# EAGLE design Bakelite Interface Board v1.1 (EAGLE 9.6.2)
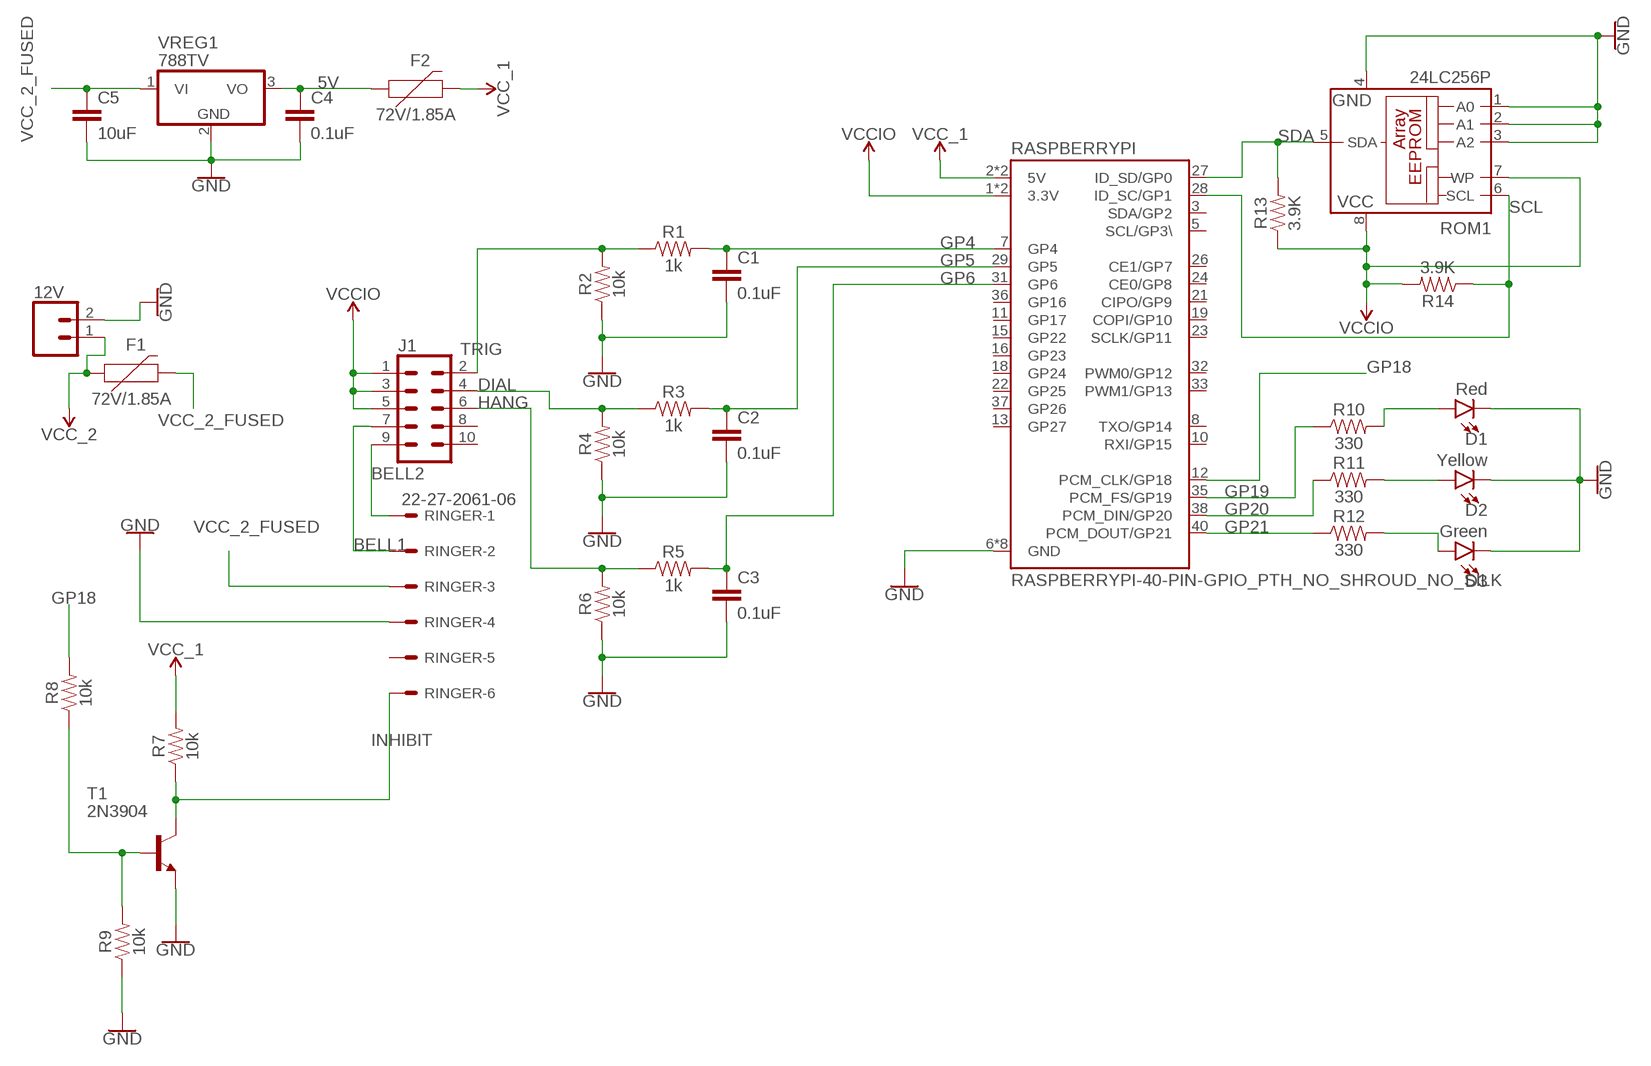
[diagram p0: schematic, sheet 1]

## Parts
12V  CONN_025MM  [SCREWTERMINAL-5MM-2]
C1  0.1uF  0.1UF-KIT-EZ-50V-20%  [CAP-PTH-SMALL-KIT]
C2  0.1uF  0.1UF-KIT-EZ-50V-20%  [CAP-PTH-SMALL-KIT]
C3  0.1uF  0.1UF-KIT-EZ-50V-20%  [CAP-PTH-SMALL-KIT]
C4  0.1uF  0.1UF-KIT-EZ-50V-20%  [CAP-PTH-SMALL-KIT]
C5  10uF  0.1UF-KIT-EZ-50V-20%  [CAP-PTH-SMALL-KIT]
D1  Red  LED5MM  [LED_5MM]
D2  Yellow  LED5MM  [LED_5MM]
D3  Green  LED5MM  [LED_5MM]
F1  72V/1.85A  PPTC_PTH  [PTH]
F2  72V/1.85A  PPTC_PTH  [PTH]
J1  CONN_05X2PTH  [2X5]
R1  1k  1KOHM-HORIZ-1/4W-5%  [AXIAL-0.3]
R2  10k  10KOHM-HORIZ-1/4W-5%  [AXIAL-0.3]
R3  1k  1KOHM-HORIZ-1/4W-5%  [AXIAL-0.3]
R4  10k  10KOHM-HORIZ-1/4W-5%  [AXIAL-0.3]
R5  1k  1KOHM-HORIZ-1/4W-5%  [AXIAL-0.3]
R6  10k  10KOHM-HORIZ-1/4W-5%  [AXIAL-0.3]
R7  10k  10KOHM-HORIZ-1/4W-5%  [AXIAL-0.3]
R8  10k  10KOHM-HORIZ-1/4W-5%  [AXIAL-0.3]
R9  10k  10KOHM-HORIZ-1/4W-5%  [AXIAL-0.3]
R10  330  330OHM-HORIZ-1/10W-5%  [AXIAL-0.3]
R11  330  330OHM-HORIZ-1/10W-5%  [AXIAL-0.3]
R12  330  330OHM-HORIZ-1/10W-5%  [AXIAL-0.3]
R13  3.9K  RESISTORAXIAL-0.3  [AXIAL-0.3]
R14  3.9K  RESISTORAXIAL-0.3  [AXIAL-0.3]
RASPBERRYPI  RASPBERRYPI-40-PIN-GPIO_PTH_NO_SHROUD_NO_SILK  [2X20_NOSILK]
RINGER  22-27-2061-06  [6410-06]
ROM1  24LC256P  [DIL8]
T1  2N3904  [TO92]
VREG1  788TV  [TO220V]

## Nets
5V: C4.1 F2.P$1 VREG1.3(VO)
BELL1: J1.7 RINGER.2
BELL2: J1.9 RINGER.1
DIAL: J1.4 R3.P$1 R4.P$2
GND: 12V.2 C1.2 C2.2 C3.2 C4.2 C5.2 D1.K(C) D2.K(C) D3.K(C) R2.P$1 R4.P$1 R6.P$1 R9.P$1 RASPBERRYPI.6(GND) RASPBERRYPI.9(GND) RASPBERRYPI.14(GND) RASPBERRYPI.20(GND) RASPBERRYPI.25(GND) RASPBERRYPI.30(GND) RASPBERRYPI.34(GND) RASPBERRYPI.39(GND) RINGER.4 ROM1.1(A0) ROM1.2(A1) ROM1.3(A2) ROM1.4(GND) T1.3(E) VREG1.2(GND)
GP4: C1.1 R1.P$2 RASPBERRYPI.7(GP4)
GP5: C2.1 R3.P$2 RASPBERRYPI.29(GP5)
GP6: C3.1 R5.P$2 RASPBERRYPI.31(GP6)
GP18: R8.P$2 RASPBERRYPI.12(PCM_CLK/GP18)
GP19: R10.P$1 RASPBERRYPI.35(PCM_FS/GP19)
GP20: R11.P$1 RASPBERRYPI.38(PCM_DIN/GP20)
GP21: R12.P$1 RASPBERRYPI.40(PCM_DOUT/GP21)
HANG: J1.6 R5.P$1 R6.P$2
INHIBIT: R7.P$1 RINGER.6 T1.1(C)
N$10: R8.P$1 R9.P$2 T1.2(B)
N$22: D1.A R10.P$2
N$23: D2.A R11.P$2
N$24: D3.A R12.P$2
SCL: R14.P$1 RASPBERRYPI.28(ID_SC/GP1) ROM1.6(SCL)
SDA: R13.P$2 RASPBERRYPI.27(ID_SD/GP0) ROM1.5(SDA)
TRIG: J1.2 R1.P$1 R2.P$2
VCC_1: F2.P$2 R7.P$2 RASPBERRYPI.2(5V) RASPBERRYPI.4(5V)
VCC_2 [2A]: 12V.1 F1.P$1
VCC_2_FUSED [2A]: C5.1 F1.P$2 RINGER.3 VREG1.1(VI)
VCCIO: J1.1 J1.3 J1.5 R13.P$1 R14.P$2 RASPBERRYPI.1(3.3V) RASPBERRYPI.17(3.3V) ROM1.7(WP) ROM1.8(VCC)
Unconnected: J1.8 J1.10 RASPBERRYPI.3(SDA/GP2) RASPBERRYPI.5(SCL/GP3\) RASPBERRYPI.8(TXO/GP14) RASPBERRYPI.10(RXI/GP15) RASPBERRYPI.11(GP17) RASPBERRYPI.13(GP27) RASPBERRYPI.15(GP22) RASPBERRYPI.16(GP23) RASPBERRYPI.18(GP24) RASPBERRYPI.19(COPI/GP10) RASPBERRYPI.21(CIPO/GP9) RASPBERRYPI.22(GP25) RASPBERRYPI.23(SCLK/GP11) RASPBERRYPI.24(CE0/GP8) RASPBERRYPI.26(CE1/GP7) RASPBERRYPI.32(PWM0/GP12) RASPBERRYPI.33(PWM1/GP13) RASPBERRYPI.36(GP16) RASPBERRYPI.37(GP26) RINGER.5

## Library data of the parts
12V = SparkFun-Connectors:CONN_02: Multi connection point. Often used as Generic Header-pin footprint for 0.1 inch spaced/style header connections On any of the 0.1 inch spaced packages, you can populate with these: Break Away Headers - Straight <https://www.sparkfun.com/products/116> (PRT-00116) Break Away Male Headers - Right Angle <https://www.sparkfun.com/products/553> (PRT-00553) Female Headers <https://www.sparkfun.com/products/115> (PRT-00115) Break Away Headers - Machine Pin <https://www.sparkfun.com/products/117> (PRT-00117) Break Away Female Headers - Swiss Machine Pin <https://www.sparkfun.com/products/743> (PRT-00743) For SCREWTERMINALS and SPRING TERMINALS visit here: Screw Terimnals on SparkFun.com <https://www.sparkfun.com/search/results?term=Screw+Terminals> (5mm/3.5mm/2.54mm spacing) This device is also useful as a general connection point to wire up your design to another part of your project. Our various solder wires solder well into these plated through hole pads. Hook-Up Wire - Assortment (Stranded, 22 AWG) <https://www.sparkfun.com/products/11375> (PRT-11375) Hook-Up Wire - Assortment (Solid Core, 22 AWG) <https://www.sparkfun.com/products/11367> (PRT-11367) View the entire wire category on our website here <https://www.sparkfun.com/categories/141> Special notes: Molex polarized connector foot print use with: PRT-08233 with associated crimp pins and housings. 2.54_SCREWTERM for use with PRT-10571. 3.5mm Screw Terminal footprints for PRT-08084 5mm Screw Terminal footprints for use with PRT-08432; SF_SKU: PRT-08432
C1-C4 = SparkFun-Capacitors:0.1UF: 0.1µF ceramic capacitors A capacitor is a passive two-terminal electrical component used to store electrical energy temporarily in an electric field.; PROD_ID: CAP-08370
C5 = SparkFun-Capacitors:0.1UF: 0.1µF ceramic capacitors A capacitor is a passive two-terminal electrical component used to store electrical energy temporarily in an electric field.; PROD_ID: CAP-08370; VALUE: 0.1uF
D1-D3 = SparkFun-LED:LED: LED (Generic) Standard schematic elements and footprints for 5mm, 3mm, 1206, and 0603 sized LEDs. Generic LEDs with no color specified.
F1 F2 = SparkFun-Fuses:PPTC: Resettable Fuse PPTC Resettable Fuse. Really a sort of resistor with a polymeric positive temperature coefficient whose resistance increases dramatically with an increase in temperature. When heated by the power passing through the resistance rises causing the current to be limited, protecting the circuit. This is achieved by the transition of the polymer from a crystalline to an amorphous state where the conductive carbon separates breaking the conductive pathways found in the cool crystalline structure. When a PPTC cools back down it resumes conducting letting the circuit turn back on. SparkFun Products: SparkFun RedBoard - Programmed with Arduino <https://www.sparkfun.com/products/12757> Pro Micro - 5V/16MHz <https://www.sparkfun.com/products/12640> Arduino Pro 328 - 5V/16MHz <https://www.sparkfun.com/products/10915> MP3 Trigger <https://www.sparkfun.com/products/13720>; PROD_ID: RES-08490; VALUE: 72V/0.25A
J1 = SparkFun-Connectors:CONN_05X2: Multi connection point. Often used as Generic Header-pin footprint for 0.1 inch spaced/style header connections For AVR SPI programming port, see special device with nice symbol: "AVR_SPI_PROG_5x2.dev" You can populate with any combo of single row headers, but if you'd like an exact match, check these: 2x5 AVR ICSP Male Header <https://www.sparkfun.com/products/778> (PRT-00778) 2x5 Pin Shrouded Header <https://www.sparkfun.com/products/8506> (PRT-08506) On any of the 0.1 inch spaced packages, you can populate with these: Break Away Headers - Straight <https://www.sparkfun.com/products/116> (PRT-00116) Break Away Male Headers - Right Angle <https://www.sparkfun.com/products/553> (PRT-00553) Female Headers <https://www.sparkfun.com/products/115> (PRT-00115) Break Away Headers - Machine Pin <https://www.sparkfun.com/products/117> (PRT-00117) Break Away Female Headers - Swiss Machine Pin <https://www.sparkfun.com/products/743> (PRT-00743) Special note: the shrouded connector mates well with our 5x2 ribbon cables: 2x5 Pin IDC Ribbon Cable <https://www.sparkfun.com/products/8535> (PRT-08535); PROD_ID: CONN-08499; SF_ID: PRT-0778
R1 R3 R5 = SparkFun-Resistors:1KOHM: 1kΩ resistor A resistor is a passive two-terminal electrical component that implements electrical resistance as a circuit element. Resistors act to reduce current flow, and, at the same time, act to lower voltage levels within circuits. - Wikipedia; PROD_ID: RES-08380
R2 R4 R6-R9 = SparkFun-Resistors:10KOHM: 10kΩ resistor A resistor is a passive two-terminal electrical component that implements electrical resistance as a circuit element. Resistors act to reduce current flow, and, at the same time, act to lower voltage levels within circuits. - Wikipedia; PROD_ID: RES-09435
R10-R12 = SparkFun-Resistors:330OHM: 330Ω resistor A resistor is a passive two-terminal electrical component that implements electrical resistance as a circuit element. Resistors act to reduce current flow, and, at the same time, act to lower voltage levels within circuits. - Wikipedia; PROD_ID: RES-8371
R13 R14 = SparkFun-Resistors:RESISTOR: Generic Resistor Package
RASPBERRYPI = SparkFun-Connectors:RASPBERRYPI-40-PIN-GPIO: Raspberry Pi GPIO Header 2x20 pin connector, as found on B, B+, A+ models. Both shrouded PTH and SMT versions available. SparkFun Products: GPIO Shrouded Header <https://www.sparkfun.com/products/13054>- PTH SparkFun Pi Wedge (Preassembled) <https://www.sparkfun.com/products/13717>
RINGER = con-molex:22-?-06: CONNECTOR wire to board 2.54 mm (.1 inch) pitch header; MF: MOLEX; OC_FARNELL: unknown; OC_NEWARK: unknown
ROM1 = microchip:24*: Serial EEPROM I2C; MF: MICROCHIP; MPN: 24LC256-E/P; OC_FARNELL: 9757970; OC_NEWARK: 92C7169
T1 = transistor:2N3904: NPN TRANSISTOR
VREG1 = linear:78*: Positive VOLTAGE REGULATOR Source: http://cache.national.com/ds/LM/LM78L05.pdf http://www.fairchildsemi.com/ds/LM/LM7805.pdf

## Net classes
1 2A: width 0.41 mm, clearance 0.65 mm

## Board
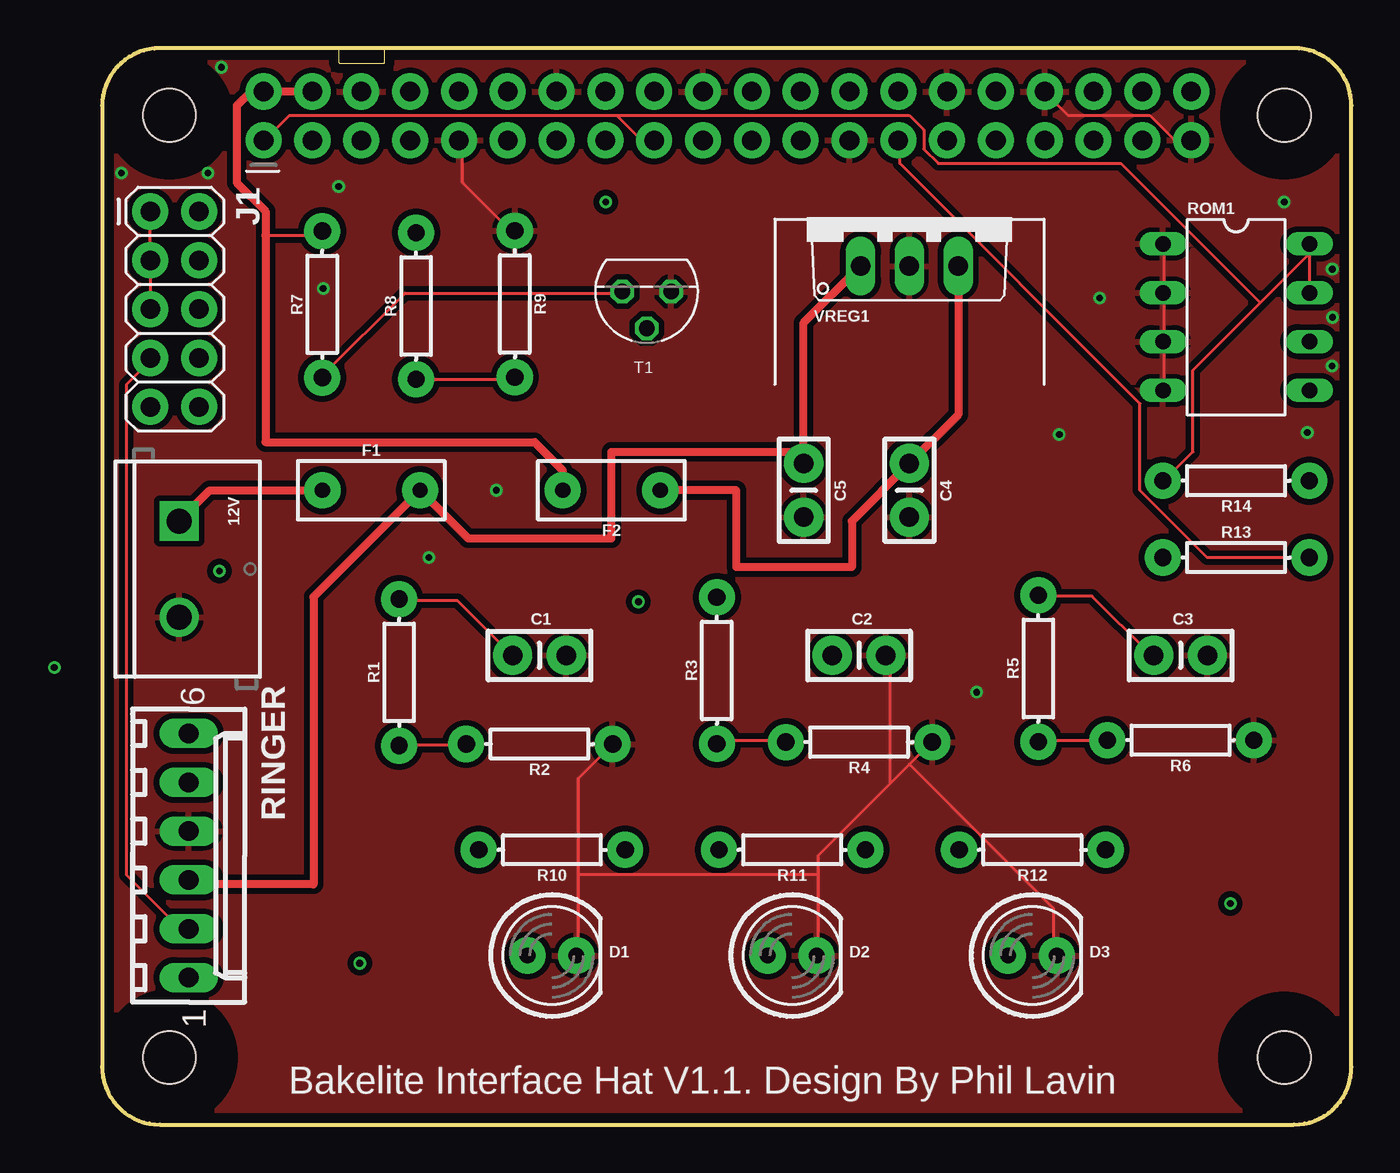
[diagram p1: board, top side]
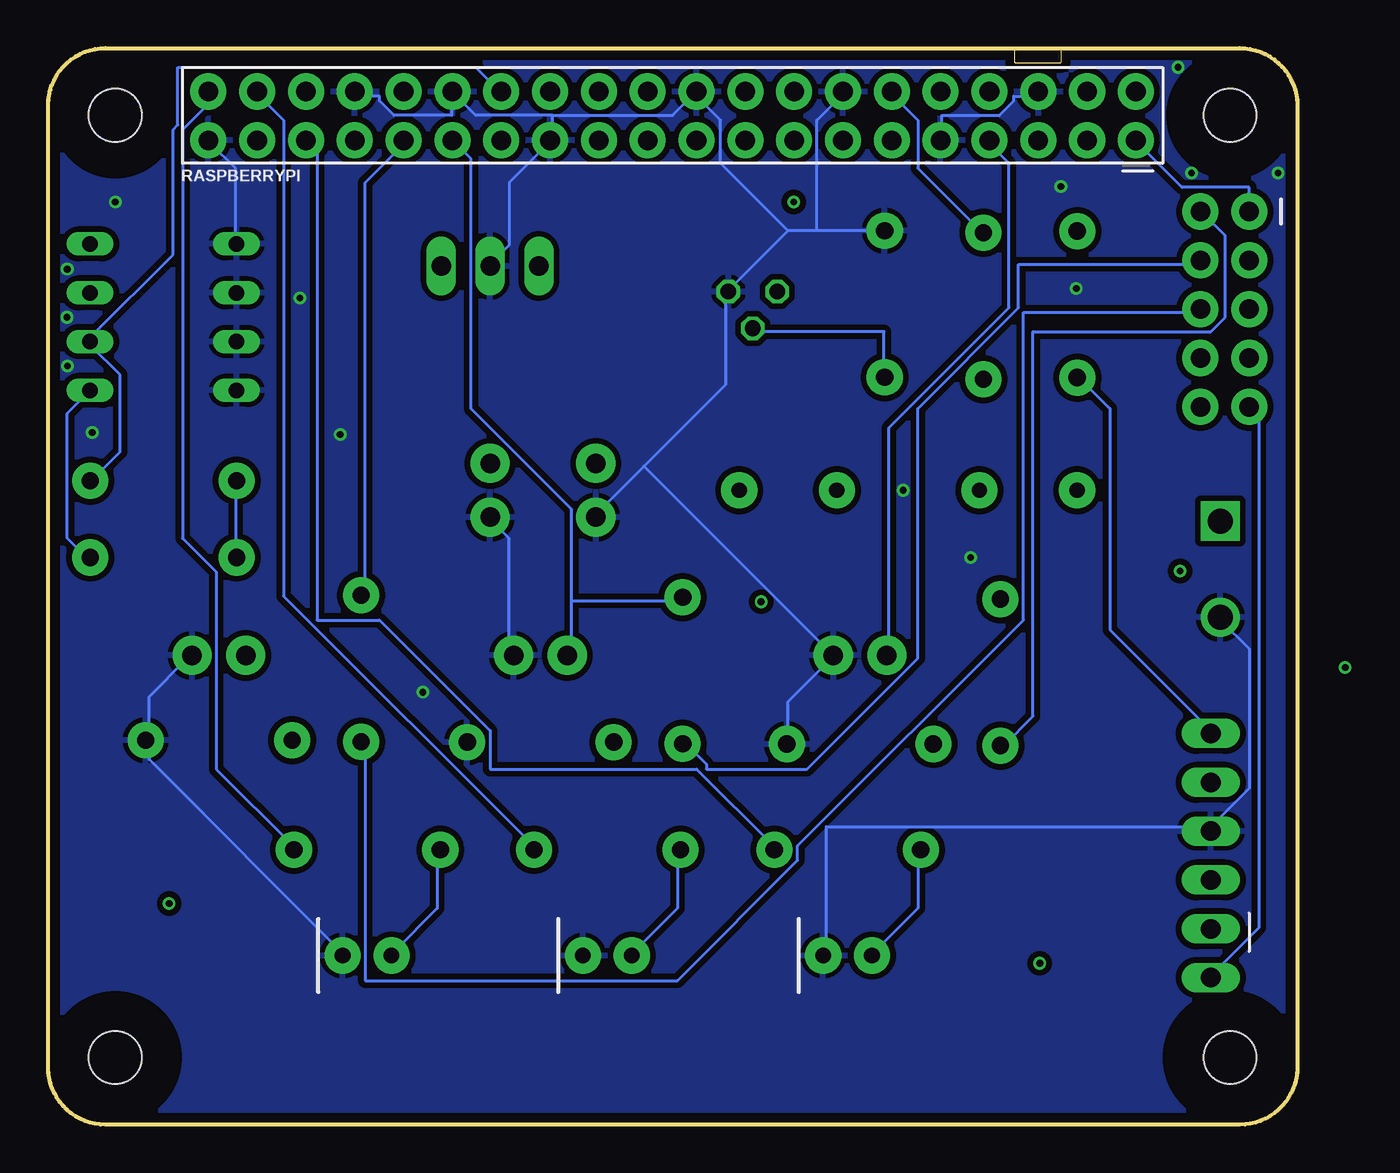
[diagram p2: board, bottom side, seen from below]

Size 65 x 56 mm. Coordinates in mm from the lower left corner, seen from the top.
Outline: 3,0 62,0 arc90 65,3 65,53 arc90 62,56 3,56 arc90 0,53 0,3 arc90 3,0
Copper layers (1*16): Top 0.035mm / dielectric 1.6mm / Bottom 0.035mm
Design rules "Elecrow_2-layer_PCB_eagle_rule": minimum track width 6mil, minimum drill 12mil, track to track 6mil, track to pad 6mil, pad to pad 6mil, via to via 8mil, smd to smd 0mil, copper to edge 20mil, drill to drill 10mil, minimum pad ring 6mil, minimum via ring 6mil, stop-mask expansion 0mil, vias tented up to drill 100mil, thermal gap 10mil
Holes 2.75 mm at 3.5,52.5 61.5,52.5 3.5,3.5 61.5,3.5
tRestrict: area 0.5,49.5 to 6.5,55.5; area 58.5,49.5 to 64.5,55.5; area 58.4,0.4 to 64.6,6.6; area 0.3,0.3 to 6.7,6.7
bRestrict: area 0.5,49.5 to 6.5,55.5; area 58.5,49.5 to 64.5,55.5; area 58.4,0.4 to 64.6,6.6; area 0.3,0.3 to 6.7,6.7

### Footprints (pad centres in the part's own frame; a part is rotated, then mirrored left to right if it is on the bottom)
SCREWTERMINAL-5MM-2 = drill 1.3 pad 2.032 square: 1 0,0 | drill 1.3 pad 2.032: 2 5,0
CAP-PTH-SMALL-KIT = drill 1.016 pad 2.032: 1 -1.397,0; 2 1.397,0
LED_5MM = drill 0.813 pad 1.88: A -1.27,0; K 1.27,0
PTH = drill 0.8 pad 1.88: P$1 -2.54,0; P$2 2.54,0
2X5 = drill 1.016 pad 1.88: 1 0,0; 2 0,2.54; 3 2.54,0; 4 2.54,2.54; 5 5.08,0; 6 5.08,2.54; 7 7.62,0; 8 7.62,2.54; 9 10.16,0; 10 10.16,2.54
AXIAL-0.3 = drill 0.9 pad 1.88: P$1 -3.81,0; P$2 3.81,0
2X20_NOSILK = drill 1.016 pad 1.88: 1 0,0; 2 0,2.54; 3 2.54,0; 4 2.54,2.54; 5 5.08,0; 6 5.08,2.54; 7 7.62,0; 8 7.62,2.54; 9 10.16,0; 10 10.16,2.54; 11 12.7,0; 12 12.7,2.54; 13 15.24,0; 14 15.24,2.54; 15 17.78,0; 16 17.78,2.54; 17 20.32,0; 18 20.32,2.54; 19 22.86,0; 20 22.86,2.54; 21 25.4,0; 22 25.4,2.54; 23 27.94,0; 24 27.94,2.54; 25 30.48,0; 26 30.48,2.54; 27 33.02,0; 28 33.02,2.54; 29 35.56,0; 30 35.56,2.54; 31 38.1,0; 32 38.1,2.54; 33 40.64,0; 34 40.64,2.54; 35 43.18,0; 36 43.18,2.54; 37 45.72,0; 38 45.72,2.54; 39 48.26,0; 40 48.26,2.54
6410-06 = drill 1.016 long: 1 6.35,0; 2 3.81,0; 3 1.27,0; 4 -1.27,0; 5 -3.81,0; 6 -6.35,0
DIL8 = drill 0.813 long: 1 -3.81,-3.81; 2 -1.27,-3.81; 3 1.27,-3.81; 4 3.81,-3.81; 5 3.81,3.81; 6 1.27,3.81; 7 -1.27,3.81; 8 -3.81,3.81
TO92 = drill 0.813 octagon: 1 1.27,0; 2 0,1.905; 3 -1.27,0
TO220V = drill 1.016 long: 1 -2.54,-2.54; 2 0,-2.54; 3 2.54,-2.54

### Placement (x,y rotation side)
12V  4,31.4 270 top
C1  22.75,24.41 0 top
C2  39.38,24.41 0 top
C3  56.11,24.41 0 top
C4  42,33 270 top
C5  36.5,33 270 top
D1  23.4,8.8 0 top
D2  35.9,8.8 0 top
D3  48.4,8.8 0 top
F1  14,33 0 top
F2  26.5,33 180 top
J1  2.5,47.5 270 top
R1  15.45,23.53 90 top
R2  22.75,19.8 180 top
R3  31.98,23.63 90 top
R4  39.38,19.9 180 top
R5  48.71,23.73 90 top
R6  56.11,20 180 top
R7  11.45,42.67 90 top
R8  16.33,42.58 90 top
R9  21.47,42.69 270 top
R10  23.4,14.3 180 top
R11  35.9,14.3 180 top
R12  48.4,14.3 180 top
R13  59,29.5 0 top
R14  59,33.5 180 top
RASPBERRYPI  8.4,51.2 0 top
RINGER  4.5,14 270 top
ROM1  59,42 270 top
T1  28.33,43.33 180 top
VREG1  42,47.2 0 top

### Tracks (layer width: path | path; a pad name or v marks a point on that pad's centre or on a via)
5V
  Top 0.41: VREG1.3 44.54,36.94 C4.1 39,31.4 39,29 33,29 33,33 F2.P$1
BELL1
  Top 0.152: RINGER.2 4.5,10.25 4,10.25 1.25,13 1.25,38.5 2.5,39.75 J1.7
BELL2
  Bottom 0.152: RINGER.1 4.5,7.75 2,10.25 2,36.75 2.5,37.25 J1.9
DIAL
  Top 0.152: R4.P$2 35.5,20 32,20 R3.P$1
  Bottom 0.152: J1.4 5.25,44.75 14.5,44.75 14.5,42.5 19.75,37.25 19.75,24.25 25.5,18.5 30.75,18.5 30.75,18.75 31.75,19.75 R3.P$1
GND  (via drill 0.35)
  Top 0.152: ROM1.4 55.25,38.25 55.25,40.5 ROM1.3 55.25,40.75 55.25,43.25 ROM1.2 55.25,43.5 55.25,45.75 ROM1.1 | RASPBERRYPI.39 56.5,51.25 55.75,51.25 54.5,52.5 50.25,52.5 49.25,53.5 RASPBERRYPI.34 | RASPBERRYPI.9 18.75,51 18.75,49 21.25,46.5 R9.P$1 | 24.75,13 24.75,18 26.5,19.75 R2.P$1 | 24.75,13 24.75,9 D1.K | 37.25,13 37.25,14 41,17.75 | 37.25,13 37.25,9 D2.K | 42,18.75 43,19.75 R4.P$1 | 42,18.75 41,17.75 | 41,17.75 41,24.25 C2.2 | 42,18.75 49.5,11.25 49.5,9 D3.K | 37.25,13 24.75,13
  Bottom 0.152: RASPBERRYPI.39 56.5,51 55.25,49.75 55.25,46 ROM1.1 | VREG1.2 42,44.75 41,45.75 41,49 39,51 RASPBERRYPI.25 38.75,51.25 38.75,52.5 | 38.75,52.5 32.5,52.5 RASPBERRYPI.20 31.25,53.5 30,52.25 30,50 26.5,46.5 | 38.75,52.5 42.75,52.5 43.75,53.5 RASPBERRYPI.30 44,53.5 44,52.5 47,52.5 47.75,53.25 47.75,53.5 49,53.5 RASPBERRYPI.34 | 26.5,46.5 29.5,43.5 T1.3 29.75,43.25 29.75,38.5 34,34.25 | R9.P$1 25,46.5 | 25,46.5 26.5,46.5 | RASPBERRYPI.6 13.5,53.5 14.75,53.5 14.75,53.25 15.5,52.5 18.5,52.5 18.5,51.25 RASPBERRYPI.9 | 25,46.5 25,52.25 23.75,53.5 RASPBERRYPI.14 | 34,34.25 36.5,31.75 C5.2 | 4.5,15.5 2.5,17.5 2.5,24.75 4,26.25 12V.2 | R2.P$1 26.5,20 26.5,22 24.25,24.25 C1.2 24.25,24.5 34,34.25 | 4.5,15.5 24.5,15.5 24.5,9 D1.K | 4.5,15.5 RINGER.4 | 59.75,20 59.75,19 49.75,9 D3.K | 59.75,20 59.75,22.25 57.75,24.25 C3.2 | 59.75,20 R6.P$1 | C4.2 42,31.5 41,30.5 41,24.5 C2.2
  other vias: 12.3,48.8 49.8,35.9 51.9,43 61.5,48 17,29.5 45.5,22.5 62.7,36 11.5,43.5 20.5,33 1,49.5 5.5,49.5 64,44.5 6.2,55 64.01,42 63.99,39.46
  pour Top (isolate 0.305): 19,56 3.5,56 3,56 arc90 0,53 0,3 arc90 3,0 60,0 62,0 arc90 65,3 65,52.5 65,53 arc90 62,56
  pour Bottom (isolate 0.305): 28,56 5,56 3,56 arc90 0,53 0,5 0,3.5 0,3 arc90 3,0 61,0 62,0 arc90 65,3 65,52 65,53 arc90 62,56
GP4
  Top 0.152: R1.P$2 15.5,27.25 18.5,27.25 21.25,24.5 C1.1
  Bottom 0.152: RASPBERRYPI.7 16,51 15,50 15,42.5 21.25,36.25 21.25,24.5 C1.1
GP5
  Bottom 0.152: 37.75,27.25 32,27.25 R3.P$2 | 37.75,27.25 37.75,24.5 C2.1 | 37.75,27.25 37.75,32 43,37.25 43,50.25 43.75,51 RASPBERRYPI.29
GP6
  Top 0.152: R5.P$2 48.75,27.5 51.5,27.5 54.5,24.5 C3.1
  Bottom 0.152: RASPBERRYPI.31 46.5,51 48.5,49 48.5,27.75 R5.P$2
GP18
  Bottom 0.152: R8.P$2 16.5,46.5 19.75,49.75 19.75,52.25 21,53.5 RASPBERRYPI.12
GP19
  Bottom 0.152: R10.P$1 27.25,14.5 31.25,18.5 42,18.5 42,20.5 47.75,26.25 51,26.25 51,50.5 51.5,51 RASPBERRYPI.35
GP20
  Bottom 0.152: R11.P$1 39.75,14.5 52.75,27.5 52.75,52.25 54,53.5 RASPBERRYPI.38
GP21
  Bottom 0.152: R12.P$1 52.25,14.5 56.25,18.5 56.25,28.75 58,30.5 58,51.75 56.75,53 56.75,53.5 RASPBERRYPI.40
HANG
  Top 0.152: R6.P$2 48.75,20 R5.P$1
  Bottom 0.152: J1.6 5.25,42.25 14.25,42.25 14.25,26.25 26,14.5 26,13.75 32.25,7.5 48.5,7.5 48.5,19.75 R5.P$1
INHIBIT
  Top 0.152: T1.1 27,43.25 15.75,43.25 11.5,39 R7.P$1
  Bottom 0.152: RINGER.6 4.5,20.5 9.75,25.75 9.75,37.25 11.25,38.75 R7.P$1
N$1  (via drill 0.35)
  other vias: 26.2,48
N$2  (via drill 0.35)
  other vias: 27.9,27.2
N$3  (via drill 0.35)
  other vias: 13.4,8.4
N$4  (via drill 0.35)
  other vias: 58.7,11.5
N$5  (via drill 0.35)
  other vias: 6.1,28.8
N$6  (via drill 0.35)
  other vias: -2.49,23.78
N$10
  Top 0.152: R8.P$1 16.5,38.75 21.25,38.75 R9.P$2
  Bottom 0.152: T1.2 28.25,41.25 21.5,41.25 21.5,39 R9.P$2
N$22
  Bottom 0.152: D1.A 22,9 19.75,11.25 19.75,14.25 R10.P$2
N$23
  Bottom 0.152: D2.A 34.5,9 32.25,11.25 32.25,14.25 R11.P$2
N$24
  Bottom 0.152: D3.A 47,9 44.75,11.25 44.75,14.25 R12.P$2
SCL
  Bottom 0.152: R14.P$1 62.75,33.5 61.25,35 61.25,39 62.75,40.5 ROM1.6 62.75,40.75 62.75,41 58.5,45.25 58.5,51.75 58.25,52 58.25,55 42.75,55 41.5,53.75 RASPBERRYPI.28
SDA
  Top 0.152: R13.P$2 57.5,29.5 54,33 54,37.5 41.5,50 41.5,51 RASPBERRYPI.27
  Bottom 0.152: ROM1.5 64,37 64,30.5 63,29.5 R13.P$2
TRIG
  Top 0.152: R1.P$1 15.5,19.75 18.75,19.75 R2.P$2
  Bottom 0.152: J1.2 5,47.5 3.75,46.25 3.75,42 4.5,41.25 13.75,41.25 13.75,21.25 15.25,19.75 R1.P$1
VCC_1
  Top 0.152: RASPBERRYPI.2 8.5,53.75 8.5,53.74 | 8.5,46.25 11.25,46.25 R7.P$2
  Top 0.41: RASPBERRYPI.4 8.5,53.74 RASPBERRYPI.2 7.74,53.74 7,53 7,49 8.5,47.5 8.5,46.25 8.5,35.5 22.5,35.5 23.96,34.04 F2.P$2
VCC_2
  Top 0.41: 12V.1 5.6,33 F1.P$1
VCC_2_FUSED
  Top 0.41: VREG1.1 36.5,41.7 C5.1 35.9,35 26.5,35 26.5,30.5 19.04,30.5 F1.P$2 11,27.46 11,12.5 4.73,12.5 RINGER.3
VCCIO
  Top 0.152: 60.25,42.75 56.75,39.25 56.75,35 55.25,33.5 R14.P$2 | 60.25,42.75 62.75,45.25 62.75,45.75 ROM1.8 ROM1.7 | J1.5 J1.3 J1.1 | 26.75,52.5 28,51.25 28.5,51.25 RASPBERRYPI.17 | 26.75,52.5 9.75,52.5 8.5,51.25 RASPBERRYPI.1 | 60.25,42.75 53,50 43.5,50 42.75,50.75 42.75,51.75 42,52.5 26.75,52.5
  Bottom 0.152: R13.P$1 55.25,29.5 55.25,33.5 R14.P$2 | J1.1 2.5,48.75 6,48.75 8.25,51 RASPBERRYPI.1

### Text on the board
tPlace: C5 | C4 | C1 | C2 | C3 | Bakelite Interface Hat V1.1. Design By Phil Lavin
tValues: 0.1uF | 0.1uF | 0.1uF